# EAGLE design Breadboard-ATTINY84 (EAGLE 7.5.0)
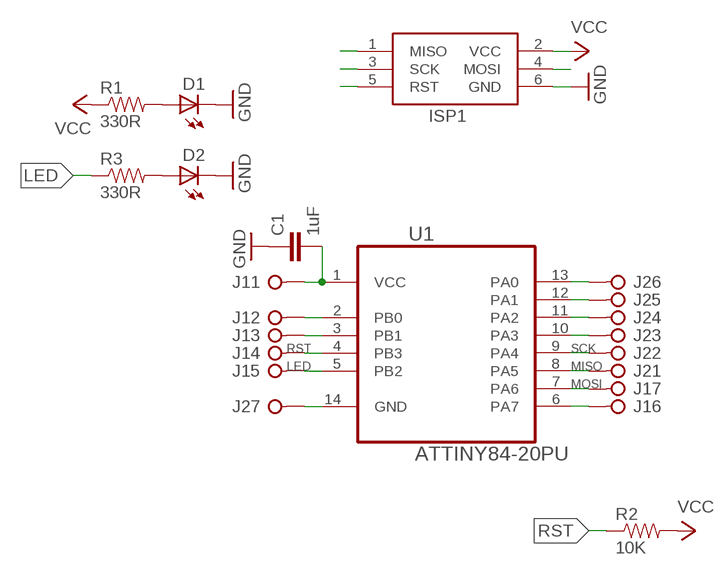
[diagram p0: schematic, sheet 1]

## Parts
C1  1uF  CAPACITOR-0805  [CAPACITOR-0805]
D1  LED-0805  [LED-0805]
D2  LED-0805  [LED-0805]
ISP1  ICSP-HEADER-6  [ICSP-HEADER]
J1  PINHD-1X7  [1X07]
J2  PINHD-1X7  [1X07]
R1  330R  RESISTOR-0805  [RESISTOR-0805]
R2  10K  RESISTOR-0805  [RESISTOR-0805]
R3  330R  RESISTOR-0805  [RESISTOR-0805]
U1  ATTINY84-20PU  [DIP14]

## Nets
GND: C1.1 D1.2(C) D2.2(C) ISP1.6(GND) J2.7 U1.14(GND)
LED: J1.5 R3.1 U1.5(PB2)
MISO: ISP1.1(MISO) J2.1 U1.8(PA5)
MOSI: ISP1.4(MOSI) J1.7 U1.7(PA6)
N$1: D2.1(A) R3.2
N$2: J1.2 U1.2(PB0)
N$3: J1.3 U1.3(PB1)
N$6: J1.6 U1.6(PA7)
N$7: D1.1(A) R1.2
N$10: J2.3 U1.10(PA3)
N$11: J2.4 U1.11(PA2)
N$12: J2.5 U1.12(PA1)
N$13: J2.6 U1.13(PA0)
RST: ISP1.5(RST) J1.4 R2.1 U1.4(PB3)
SCK: ISP1.3(SCK) J2.2 U1.9(PA4)
VCC: C1.2 ISP1.2(VCC) J1.1 R1.1 R2.2 U1.1(VCC)

## Library data of the parts
C1 = SaintGimp:CAPACITOR-*: Ceramic Capacitor
D1 D2 = SaintGimp:LED-*
ISP1 = SaintGimp:ICSP-HEADER: ICSP HEADER Standard 6 pin header for ICSP programming
J1 J2 = SaintGimp:PINHD-1X7
R1-R3 = SaintGimp:RESISTOR-*
U1 = SaintGimp:ATTINY84-20PU: 8-bit Microcontroller with In-System Programmable Flash; MPN: ATTINY84-20PU; OC_FARNELL: -; OC_NEWARK: 58M3794; PACKAGE: PDIP-14; SUPPLIER: Atmel

## Board
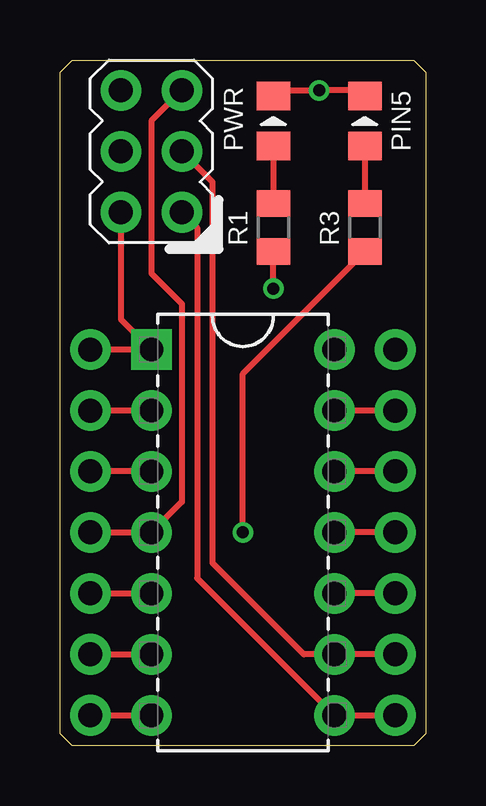
[diagram p1: board, top side]
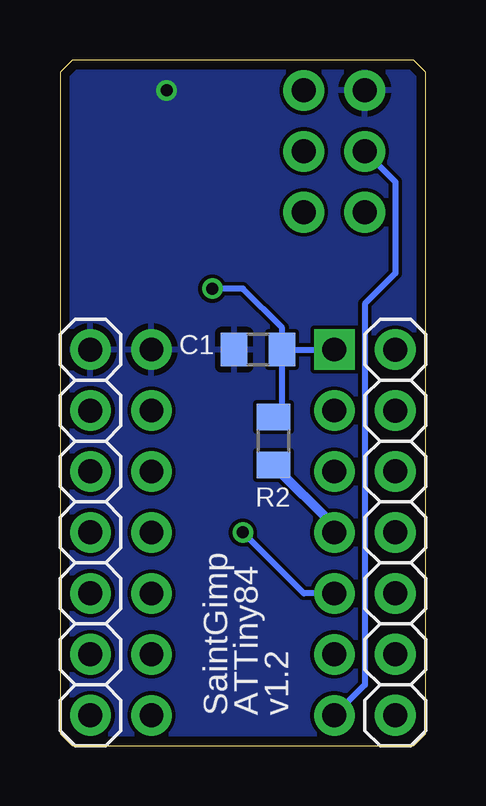
[diagram p2: board, bottom side, seen from below]

Size 15.24 x 28.57 mm. Coordinates in mm from the lower left corner, seen from the top.
Outline: 0,0.51 0,28.07 0.51,28.57 14.73,28.57 15.24,28.07 15.24,0.51 14.73,0 0.51,0 0,0.51
Copper layers (1*16): Top 0.0356mm / dielectric 1.5011mm / Bottom 0.0356mm
Design rules "Saintgimp-OSHPark *": minimum track width 10mil, minimum drill 13mil, track to track 6mil, track to pad 6mil, pad to pad 6mil, via to via 6mil, smd to smd 6mil, copper to edge 15mil, drill to drill 6mil, minimum pad ring 12mil, minimum via ring 7mil, stop-mask expansion 2mil, vias tented up to drill 24mil, thermal gap 10mil

### Footprints (pad centres in the part's own frame; a part is rotated, then mirrored left to right if it is on the bottom)
CAPACITOR-0805 = smd 1.1 x 1.4: 1 -1,0; 2 1,0
LED-0805 = smd 1.194 x 1.4: 1 -1.047,0; 2 1.047,0
ICSP-HEADER = drill 1: 1 -1.27,2.54; 2 1.27,2.54; 3 -1.27,0; 4 1.27,0; 5 -1.27,-2.54; 6 1.27,-2.54
1X07 = drill 1: 1 -7.62,0; 2 -5.08,0; 3 -2.54,0; 4 0,0; 5 2.54,0; 6 5.08,0; 7 7.62,0
RESISTOR-0805 = smd 1.1 x 1.4: 1 -1,0; 2 1,0
DIP14 = drill 0.991 square: 1 -3.81,7.62 | drill 0.991: 2 -3.81,5.08; 3 -3.81,2.54; 4 -3.81,0; 5 -3.81,-2.54; 6 -3.81,-5.08; 7 -3.81,-7.62; 8 3.81,-7.62; 9 3.81,-5.08; 10 3.81,-2.54; 11 3.81,0; 12 3.81,2.54; 13 3.81,5.08; 14 3.81,7.62

### Placement (x,y rotation side)
C1  6.99,16.51 0 bottom
D1  8.89,26.04 90 top
D2  12.7,26.04 90 top
ISP1  3.81,24.77 180 top
J1  1.27,8.89 270 bottom
J2  13.97,8.89 90 bottom
R1  8.89,21.59 90 top
R2  6.35,12.7 90 bottom
R3  12.7,21.59 90 top
U1  7.62,8.89 0 top

### Tracks (layer width: path | path; a pad name or v marks a point on that pad's centre or on a via)
GND  (via drill 0.5)
  Top 0.254: D1.2 9.16,27.3 v10.79,27.3 12.43,27.3 D2.2
  pour Bottom: 0,28.57 15.24,28.57 15.24,0 0,0
LED  (via drill 0.5)
  Top 0.254: J1.5 U1.5 | v7.62,8.89 7.62,15.51 R3.1
  Bottom 0.254: U1.5 5.08,6.35 v7.62,8.89
MISO
  Top 0.254: J2.1 U1.8 5.71,6.99 5.71,21.59 ISP1.1
MOSI
  Top 0.254: J1.7 U1.7
  Bottom 0.254: U1.7 2.54,2.54 2.54,18.41 1.27,19.68 1.27,23.5 ISP1.4
N$1
  Top 0.254: D2.1 R3.2
N$2
  Top 0.254: U1.2 J1.2
N$3
  Top 0.254: U1.3 J1.3
N$6
  Top 0.254: J1.6 U1.6
N$7
  Top 0.254: D1.1 R1.2
N$10
  Top 0.254: J2.3 U1.10
N$11
  Top 0.254: J2.4 U1.11
N$12
  Top 0.254: J2.5 U1.12
N$13
  Top 0.254: J2.6 U1.13
RST
  Top 0.254: J1.4 U1.4 5.08,10.16 5.08,18.41 3.81,19.68 3.81,26.04 ISP1.5
  Bottom 0.406: U1.4 3.81,9.16 R2.1
SCK
  Top 0.254: J2.2 U1.9 10.16,3.81 6.35,7.62 6.35,23.5 ISP1.3
VCC  (via drill 0.5)
  Top 0.254: ISP1.2 2.54,17.78 U1.1 J1.1 | v8.89,19.05 R1.1
  Bottom 0.254: R2.2 5.99,14.06 C1.2 | C1.2 U1.1 | C1.2 5.99,17.41 7.62,19.05 v8.89,19.05

### Text on the board
_tsilk: PWR | PIN5
_bsilk: v1.2 | ATTiny84 | SaintGimp